# EAGLE design Adapter_Board(v1) (EAGLE 9.6.2)
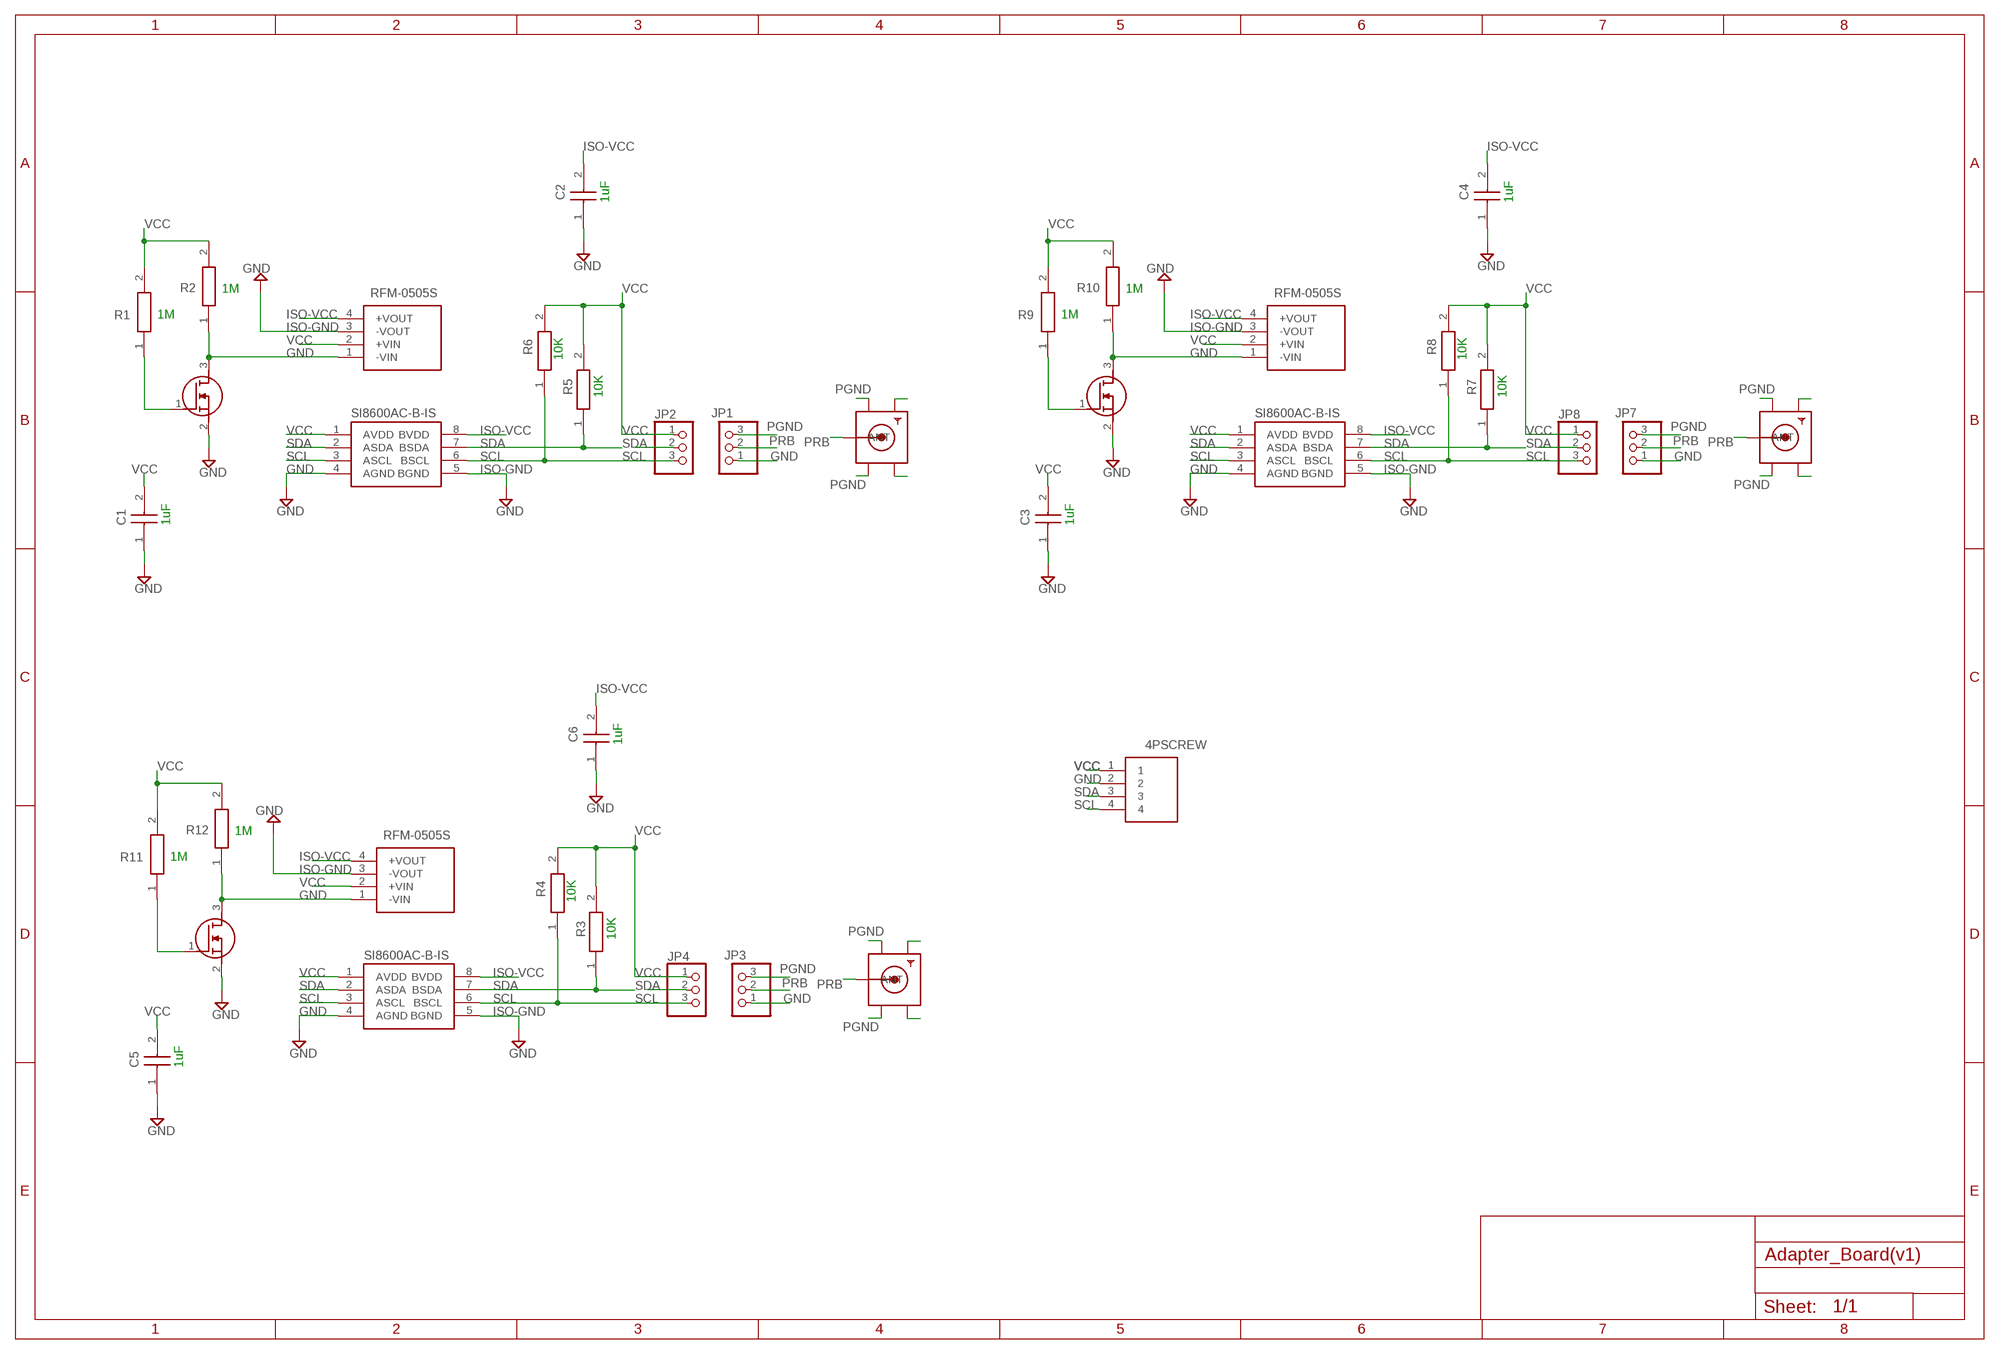
[diagram p0: schematic, sheet 1]

## Parts
4PSCREW  1725672  [1725672]
C1  C1608X5R1E105K080AC  [CAPC1608X80N]
C2  C1608X5R1E105K080AC  [CAPC1608X80N]
C3  C1608X5R1E105K080AC  [CAPC1608X80N]
C4  C1608X5R1E105K080AC  [CAPC1608X80N]
C5  C1608X5R1E105K080AC  [CAPC1608X80N]
C6  C1608X5R1E105K080AC  [CAPC1608X80N]
IC1  SI8600AC-B-IS  [SOIC127P600X175-8N]
IC2  SI8600AC-B-IS  [SOIC127P600X175-8N]
IC4  SI8600AC-B-IS  [SOIC127P600X175-8N]
JP1  PINHD-1X3  [1X03]
JP2  PINHD-1X3  [1X03]
JP3  PINHD-1X3  [1X03]
JP4  PINHD-1X3  [1X03]
JP7  PINHD-1X3  [1X03]
JP8  PINHD-1X3  [1X03]
PS1  RFM-0505S  [RFM0505S]
PS3  RFM-0505S  [RFM0505S]
PS4  RFM-0505S  [RFM0505S]
Q1  BSS119NH6327XTSA1  [SOT95P260X110-3N]
Q2  BSS119NH6327XTSA1  [SOT95P260X110-3N]
Q3  BSS119NH6327XTSA1  [SOT95P260X110-3N]
R1  ERJ-3EKF1004V  [RESC1608X55N]
R2  ERJ-3EKF1004V  [RESC1608X55N]
R3  CRCW060310K0FKEAHP  [RESC1608X50N]
R4  CRCW060310K0FKEAHP  [RESC1608X50N]
R5  CRCW060310K0FKEAHP  [RESC1608X50N]
R6  CRCW060310K0FKEAHP  [RESC1608X50N]
R7  CRCW060310K0FKEAHP  [RESC1608X50N]
R8  CRCW060310K0FKEAHP  [RESC1608X50N]
R9  ERJ-3EKF1004V  [RESC1608X55N]
R10  ERJ-3EKF1004V  [RESC1608X55N]
R11  ERJ-3EKF1004V  [RESC1608X55N]
R12  ERJ-3EKF1004V  [RESC1608X55N]
X1  SMACONNECTOR_EDGE  [SMA_EDGELAUNCH]
X2  SMACONNECTOR_EDGE  [SMA_EDGELAUNCH]
X4  SMACONNECTOR_EDGE  [SMA_EDGELAUNCH]

## Nets
GND: 4PSCREW.2 C1.1 C2.1 C3.1 C4.1 C5.1 C6.1 IC1.4(AGND) IC2.4(AGND) IC4.4(AGND) JP1.1 JP3.1 JP7.1 PS1.1(-VIN) PS3.1(-VIN) PS4.1(-VIN) Q1.2(S) Q1.3(D) Q2.2(S) Q2.3(D) Q3.2(S) Q3.3(D) R2.1 R10.1 R12.1
ISO-GND: IC1.5(BGND) IC2.5(BGND) IC4.5(BGND) PS1.3(-VOUT) PS3.3(-VOUT) PS4.3(-VOUT) ; supply symbol labelled GND
ISO-VCC: C2.2 C4.2 C6.2 IC1.8(BVDD) IC2.8(BVDD) IC4.8(BVDD) PS1.4(+VOUT) PS3.4(+VOUT) PS4.4(+VOUT)
N$2: Q1.1(G) R1.1
N$3: X4.GND@3(GND2)
N$4: X2.GND@3(GND2)
N$5: X2.GND@1(GND4)
N$7: X4.GND@1(GND4)
N$8: Q3.1(G) R11.1
N$11: X1.GND@3(GND2)
N$12: X1.GND@1(GND4)
N$14: Q2.1(G) R9.1
PGND: JP1.3 JP3.3 JP7.3 X1.GND@2(GND3) X1.GND@4(GND1) X2.GND@2(GND3) X2.GND@4(GND1) X4.GND@2(GND3) X4.GND@4(GND1)
PRB: JP1.2 JP3.2 JP7.2 X1.P(ANT) X2.P(ANT) X4.P(ANT)
SCL: 4PSCREW.4 IC1.3(ASCL) IC1.6(BSCL) IC2.3(ASCL) IC2.6(BSCL) IC4.3(ASCL) IC4.6(BSCL) JP2.3 JP4.3 JP8.3 R4.1 R6.1 R8.1
SDA: 4PSCREW.3 IC1.2(ASDA) IC1.7(BSDA) IC2.2(ASDA) IC2.7(BSDA) IC4.2(ASDA) IC4.7(BSDA) JP2.2 JP4.2 JP8.2 R3.1 R5.1 R7.1
VCC: 4PSCREW.1 C1.2 C3.2 C5.2 IC1.1(AVDD) IC2.1(AVDD) IC4.1(AVDD) JP2.1 JP4.1 JP8.1 PS1.2(+VIN) PS3.2(+VIN) PS4.2(+VIN) R1.2 R2.2 R3.2 R4.2 R5.2 R6.2 R7.2 R8.2 R9.2 R10.2 R11.2 R12.2

## Notes on the sheet
- 1uF | 1uF
- 1M | 1M
- 1M | 1M
- 10K | 10K
- 10K | 10K
- 1uF | 1uF
- 1uF
- 1M
- 1M
- 10K
- 10K
- 1uF

## Library data of the parts
4PSCREW = 4pin_screw:1725672: 4 way vertical PCB terminal,6A 63V Phoenix Contact Non-Fused Terminal Block, 4 Way, Solder Terminals, 26 ??? 20 AWG Through Hole, Nylon, 63 V Source: Datasheet <https://datasheet.datasheetarchive.com/originals/distributors/SFDatasheet-2/sf-00050602.pdf>; DESCRIPTION: 4 way vertical PCB terminal,6A 63V Phoenix Contact Non-Fused Terminal Block, 4 Way, Solder Terminals, 26 ??? 20 AWG Through Hole, Nylon, 63 V; HEIGHT: 8.65mm; MANUFACTURER_NAME: Phoenix Contact; MANUFACTURER_PART_NUMBER: 1725672; MOUSER_PART_NUMBER: 651-1725672; MOUSER_PRICE-STOCK: https://www.mouser.co.uk/ProductDetail/Phoenix-Contact/1725672?qs=Ul7CXFMnlWXX93F9bOV2pQ%3D%3D
C1-C6 = C1608X5R1E105K080AC (1uF):C1608X5R1E105K080AC: MULTILAYER CERAMIC CHIP CAPACITORS, 1608, Commercial grade, general (Up to 75V) Source: Datasheet <https://product.tdk.com/info/en/catalog/datasheets/mlcc_commercial_midvoltage_en.pdf>; DESCRIPTION: MULTILAYER CERAMIC CHIP CAPACITORS, 1608, Commercial grade, general (Up to 75V); HEIGHT: 0.8mm; MANUFACTURER_NAME: TDK; MANUFACTURER_PART_NUMBER: C1608X5R1E105K080AC; MOUSER_PART_NUMBER: 810-C1608X5R1E105K; MOUSER_PRICE-STOCK: https://www.mouser.co.uk/ProductDetail/TDK/C1608X5R1E105K080AC?qs=NRhsANhppD9KvcnEkFA5Bw%3D%3D
IC1 IC2 IC4 = Digital Isolator:SI8600AC-B-IS: Isolator,digital,I2C,1.7MHz,3.7kV,SOIC8N Silicon Labs Si8600AC-B-IS PCB SMT 2-channel I2C Digital Isolator, 3.75 kVrms, 8-Pin SOIC Source: Datasheet <https://datasheet.datasheetarchive.com/originals/distributors/Datasheets_SAMA/8fa95c8fb9148355fcc305de833d4897.pdf>; ARROW_PART_NUMBER: SI8600AC-B-IS; ARROW_PRICE-STOCK: https://www.arrow.com/en/products/si8600ac-b-is/silicon-labs; DESCRIPTION: Isolator,digital,I2C,1.7MHz,3.7kV,SOIC8N Silicon Labs Si8600AC-B-IS PCB SMT 2-channel I2C Digital Isolator, 3.75 kVrms, 8-Pin SOIC; HEIGHT: 1.75mm; MANUFACTURER_NAME: Silicon Labs; MANUFACTURER_PART_NUMBER: Si8600AC-B-IS; MOUSER_PART_NUMBER: 634-SI8600AC-B-IS; MOUSER_PRICE-STOCK: https://www.mouser.co.uk/ProductDetail/Silicon-Labs/SI8600AC-B-IS/?qs=j6MGy4L9yX3Cr1m5JEs1OA%3D%3D
JP1-JP4 JP7 JP8 = adafruit:PINHD-1X3: PIN HEADER
PS1 PS3 PS4 = RFM-0505S:RFM-0505S: RECOM POWER - RFM-0505S - DC-DC CONVERTER, 5V, 0.2A Source: Datasheet <https://www.recom-power.com/pdf/Econoline/RFM.pdf>; DESCRIPTION: RECOM POWER - RFM-0505S - DC-DC CONVERTER, 5V, 0.2A; HEIGHT: 10.5mm; MANUFACTURER_NAME: RECOM Power; MANUFACTURER_PART_NUMBER: RFM-0505S; MOUSER_PART_NUMBER: 919-RFM-0505S; MOUSER_PRICE-STOCK: https://www.mouser.co.uk/ProductDetail/RECOM-Power/RFM-0505S?qs=lYGu3FyN48dRVYKTH5ipqg%3D%3D
Q1-Q3 = BSS119NH6327XTSA1 (NMOS):BSS119NH6327XTSA1: Infineon BSS119NH6327XTSA1 N-channel MOSFET Transistor, 0.19 A, 100 V, 3-Pin SOT-23 Source: Datasheet <https://www.infineon.com/dgdl/Infineon-BSS119N-DS-v02_01-en.pdf?fileId=db3a304335f1f4b6013639b6532a164a>; DESCRIPTION: Infineon BSS119NH6327XTSA1 N-channel MOSFET Transistor, 0.19 A, 100 V, 3-Pin SOT-23; HEIGHT: 1.1mm; MANUFACTURER_NAME: Infineon; MANUFACTURER_PART_NUMBER: BSS119NH6327XTSA1; MOUSER_PART_NUMBER: 726-BSS119NH6327XTSA; MOUSER_PRICE-STOCK: https://www.mouser.co.uk/ProductDetail/Infineon-Technologies/BSS119NH6327XTSA1?qs=LxJ0xX%2FWJR7UdSkkikNkig%3D%3D
R1 R2 R9-R12 = ERJ-3EKF1004V (1M):ERJ-3EKF1004V: Precision Thick Film Chip Resistor, 0603, 0.1W Source: Datasheet <http://industrial.panasonic.com/cdbs/www-data/pdf/RDA0000/AOA0000C86.pdf>; DESCRIPTION: Precision Thick Film Chip Resistor, 0603, 0.1W; HEIGHT: 0.55mm; MANUFACTURER_NAME: Panasonic; MANUFACTURER_PART_NUMBER: ERJ-3EKF1004V; MOUSER_PART_NUMBER: 667-ERJ-3EKF1004V; MOUSER_PRICE-STOCK: https://www.mouser.co.uk/ProductDetail/Panasonic/ERJ-3EKF1004V?qs=6%252BUraArZVSCwybhfQn7iYg%3D%3D
R3-R8 = CRCW060310K0FKEAHP:CRCW060310K0FKEAHP: CRCW Power Resistor 0603 0.25W 10K 1% Vishay CRCW Series Thick Film Power Resistor 0603 Case 10k?? ??1% 0.25W ??100ppm/K Source: Datasheet <http://www.vishay.com/docs/20043/crcwhpe3.pdf>; DESCRIPTION: CRCW Power Resistor 0603 0.25W 10K 1% Vishay CRCW Series Thick Film Power Resistor 0603 Case 10k?? ??1% 0.25W ??100ppm/K; HEIGHT: 0.5mm; MANUFACTURER_NAME: Vishay; MANUFACTURER_PART_NUMBER: CRCW060310K0FKEAHP; MOUSER_PART_NUMBER: 71-CRCW060310K0FKEAH; MOUSER_PRICE-STOCK: https://www.mouser.co.uk/ProductDetail/Vishay-Dale/CRCW060310K0FKEAHP?qs=FlFvgi4rxBwhwmNEaK0SzQ%3D%3D
X1 X2 X4 = adafruit:SMACONNECTOR: SMA Connector 90° DIP SMA Connector, 50 Ohm (4UConnector: 07259)

## Board
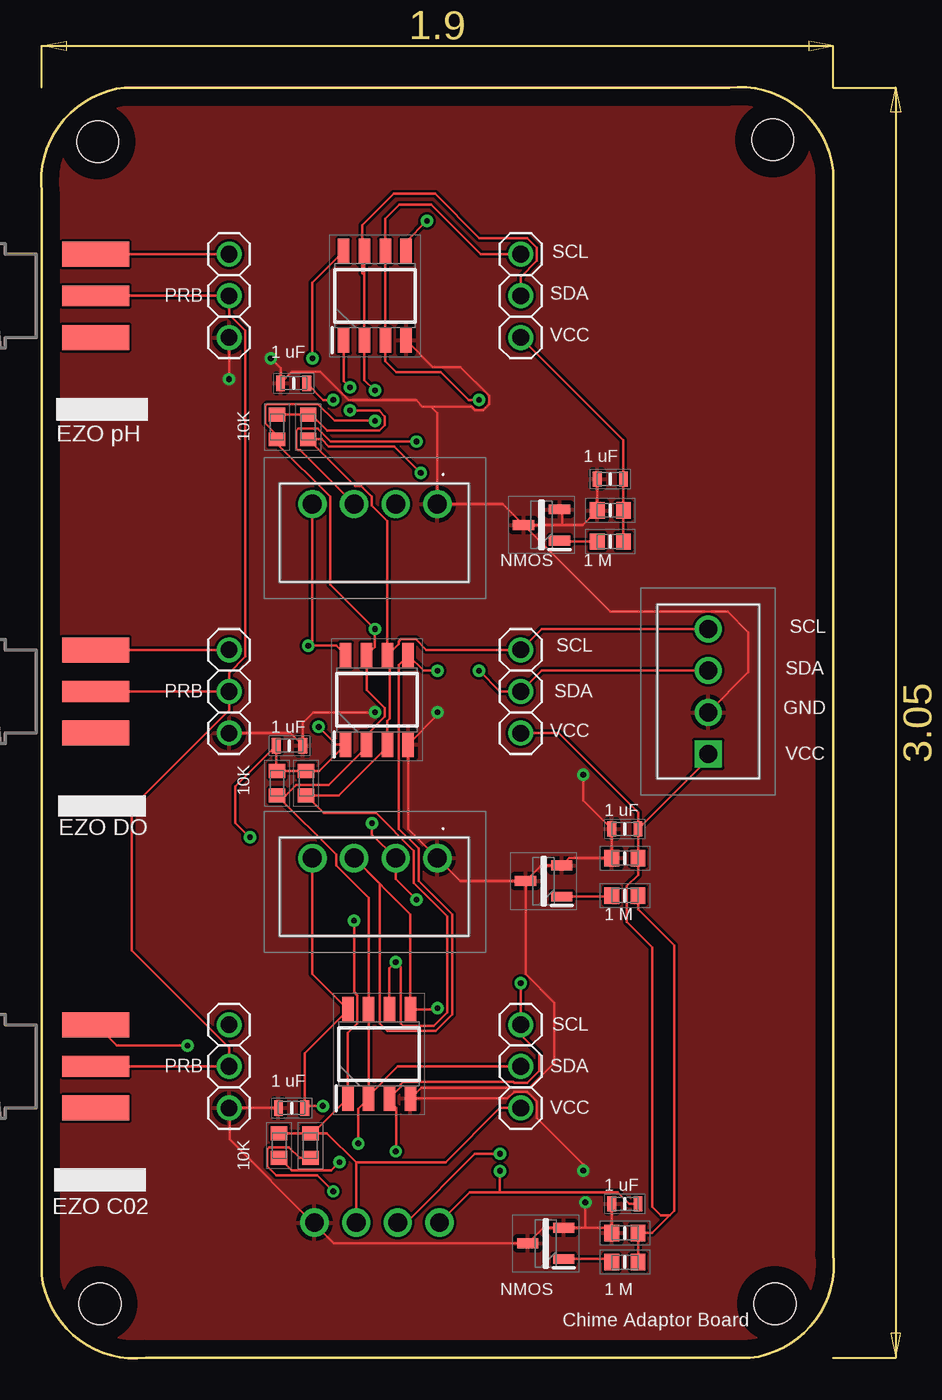
[diagram p1: board, top side]
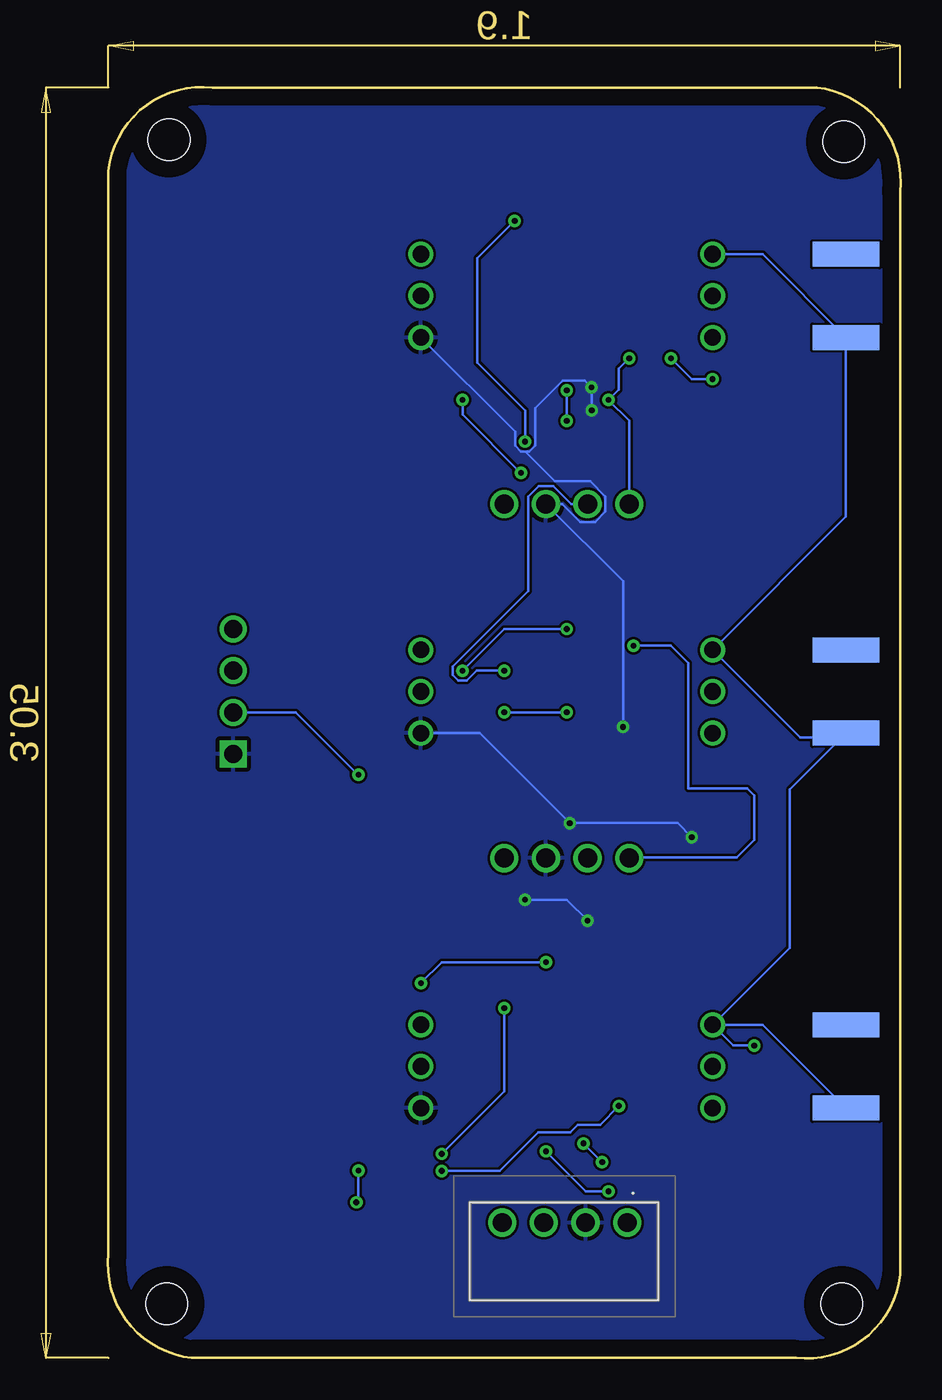
[diagram p2: board, bottom side, seen from below]

Size 48.33 x 77.54 mm. Coordinates in mm from the lower left corner, seen from the top.
Outline: 0.03,71.15 arc-90 5.11,77.5 41.94,77.5 arc-90 48.29,72.42 48.29,6.38 arc-90 43.21,0.03 6.38,0.03 arc-90 0.03,5.11 0.03,71.15
Copper layers (1*16): Top 0.035mm / dielectric 1.5mm / Bottom 0.035mm
Design rules "default": minimum track width 6mil, minimum drill 0.35mm, track to track 6mil, track to pad 6mil, pad to pad 6mil, via to via 6mil, smd to smd 6mil, copper to edge 40mil, drill to drill 6mil, minimum pad ring 10mil, minimum via ring 8mil, stop-mask expansion 4mil, vias tented up to drill 0mil, thermal gap 10mil
Holes 2.54 mm at 44.74,3.34 3.59,3.34 3.46,74.2 44.61,74.33

### Footprints (pad centres in the part's own frame; a part is rotated, then mirrored left to right if it is on the bottom)
1725672 = drill 1.1 pad 1.65 square: 1 0,0 | drill 1.1 pad 1.65: 2 2.54,0; 3 5.08,0; 4 7.62,0
CAPC1608X80N = smd 0.54 x 0.94: 1 -0.8,0; 2 0.8,0
SOIC127P600X175-8N = smd 1.525 x 0.7: 1 -2.712,1.905; 2 -2.712,0.635; 3 -2.712,-0.635; 4 -2.712,-1.905; 5 2.712,-1.905; 6 2.712,-0.635; 7 2.712,0.635; 8 2.712,1.905
1X03 = drill 1.016: 1 -2.54,0; 2 0,0; 3 2.54,0
RFM0505S = drill 1.15 pad 1.725: 1 0,0; 2 2.54,0; 3 5.08,0; 4 7.62,0
SOT95P260X110-3N = smd 1.3 x 0.6: 1 -1.1,0.95; 2 -1.1,-0.95; 3 1.1,0
RESC1608X55N = smd 0.9 x 1: 1 -0.8,0; 2 0.8,0
RESC1608X50N = smd 0.85 x 1: 1 -0.75,0; 2 0.75,0
SMA_EDGELAUNCH = smd 4.064 x 1.524: GND@1 2.032,-2.54; GND@2 2.032,2.54 | smd 4.064 x 1.524 bottom: GND@3 2.032,2.54; GND@4 2.032,-2.54 | smd 4.064 x 1.27: P 2.032,0

### Placement (x,y rotation side)
4PSCREW  40.67,36.86 90 top
C1  35.59,32.29 0 top
C2  35.59,9.43 0 top
C3  15.15,37.37 180 top
C4  15.27,15.27 0 top
C5  34.71,53.63 0 top
C6  15.4,59.47 0 top
IC1  20.61,18.58 90 top
IC2  20.35,64.8 90 top
IC4  20.48,40.17 90 top
JP1  11.46,17.81 90 top
JP2  29.24,17.81 90 top
JP3  11.46,64.8 90 top
JP4  29.24,64.8 90 top
JP7  11.46,40.67 90 top
JP8  29.24,40.67 90 top
PS1  24.16,52.1 180 top
PS3  16.67,8.29 180 bottom
PS4  24.16,30.51 180 top
Q1  30.77,7.02 180 top
Q2  30.64,29.12 180 top
Q3  30.51,50.83 180 top
R1  35.59,5.88 0 top
R2  35.59,30.51 0 top
R3  14.39,56.8 90 top
R4  16.29,56.8 90 top
R5  14.51,12.99 90 top
R6  16.42,12.99 90 top
R7  14.39,35.09 90 top
R8  16.16,35.09 90 top
R9  35.59,28.23 0 top
R10  35.59,7.65 0 top
R11  34.71,49.82 0 top
R12  34.71,51.72 0 top
X1  1.3,40.67 0 top
X2  1.3,64.8 0 top
X4  1.3,17.81 0 top

### Tracks (layer width: path | path; a pad name or v marks a point on that pad's centre or on a via)
GND  (via drill 0.35)
  Top 0.152: C4.1 JP1.1 11.5,15.24 11.5,13.37 16.58,8.29 | PS3.1 16.58,8.29 | 33.05,7.97 Q1.2 30.62,7.97 Q1.3 17.85,7.02 16.58,8.29 | 33.05,7.97 34.48,7.97 R10.1 C2.1 | v33.05,11.46 33.05,11.85 30.24,14.66 30.24,15.68 29.65,16.27 28.83,16.27 28.43,15.86 IC1.4 23.17,16.52 29.78,16.52 31.3,18.04 31.3,21.7 29.54,23.46 Q2.3 | v33.18,9.52 33.18,8.1 33.05,7.97 | Q2.3 25.56,29.12 PS4.1 22.39,32.29 IC4.4 24.16,39.23 v24.16,39.4 | JP7.1 15.19,38.13 C3.1 15.95,38.77 16.58,39.4 v20.35,39.4 | C5.1 R12.1 33.02,50.83 31.78,50.83 | 31.78,50.83 Q3.3 | Q3.3 29.41,50.81 34.69,45.54 41.86,45.54 43.13,44.27 43.13,41.86 4PSCREW.2 | Q3.3 28.14,52.1 PS1.1 24.16,57.65 23.76,58.05 | JP3.1 v11.46,59.72 | v14,60.99 14.6,60.4 C6.1 15.3,60.17 17.03,60.17 18.77,58.43 22.87,58.43 23.25,58.05 23.76,58.05 | IC2.4 23.88,60.47 25.55,60.47 27.31,58.71 27.31,58.2 26.96,57.85 26.45,57.85 26.25,58.05 23.76,58.05 | Q2.3 30.49,30.07 Q2.2 32.19,30.51 R2.1 C1.1 33.05,34.03 v33.05,35.59 | Q3.2 31.78,51.61 31.78,50.83
  Bottom 0.152: v33.05,11.46 33.05,9.91 33.18,9.78 v33.18,9.52 | v20.35,39.4 v24.16,39.4 | v11.46,59.72 12.73,59.72 v14,60.99 | v33.05,35.59 36.86,39.4 4PSCREW.2
  pour Top: 0.03,77.5 48.29,77.5 48.29,0.03 0.03,0.03
ISO-GND  (via drill 0.35)
  Top 0.152: PS3.3 22.26,8.29 26.45,12.48 v27.97,12.48 | v24.16,21.37 24.08,21.29 IC1.5 22.51,27.09 PS4.3 20.66,28.93 20.66,20.43 21.1,19.99 24.08,19.99 25.08,20.99 25.08,27.08 23.02,29.14 23.02,31.09 21.81,32.31 21.81,42.3 IC4.5 23.32,41.94 v24.16,41.94 | PS1.3 15.79,55.4 15.7,55.4 15.56,55.53 15.56,56.57 15.7,56.71 16.89,56.71 17.68,55.91 v22.89,55.91 | v23.53,69.38 22.26,68.11 IC2.5
  Bottom 0.152: v27.97,12.48 24.16,16.29 v24.16,21.37 | v24.16,41.94 25.85,41.94 26.45,41.34 26.96,41.34 27.31,41.69 27.31,42.2 22.72,46.79 22.72,52.56 22.08,53.2 21.17,53.2 20.08,52.1 PS1.3 | v22.89,55.91 22.89,57.82 25.82,60.74 25.82,67.09 v23.53,69.38
ISO-VCC  (via drill 0.35)
  Top 0.152: C2.2 35.86,9.43 35.16,10.13 27.97,10.13 | 27.97,10.13 26.13,10.13 PS3.4 | v17.18,15.4 16.2,15.4 C4.2 16.07,18.61 18.7,21.24 IC1.8 16.54,23.45 PS4.4 | v27.97,11.44 27.97,10.13 | IC4.8 17.99,43.47 v16.29,43.47 16.54,43.72 PS1.4 | IC2.8 16.54,65.61 v16.54,60.99 | v17.81,58.45 17.22,58.45 C6.2
  Bottom 0.152: v27.97,11.44 24.44,11.44 22.08,13.8 20.15,13.8 19.69,14.26 18.32,14.26 v17.18,15.4 | PS4.4 16.52,30.54 10,30.54 8.92,31.62 8.92,34.32 9.35,34.75 12.94,34.75 12.94,42.4 14,43.47 v16.29,43.47 | v16.54,60.99 17.18,60.36 17.18,59.09 v17.81,58.45 16.54,57.18 PS1.4
N$2
  Top 0.152: Q1.1 34.6,6.07 R1.1
N$8
  Top 0.152: Q3.1 31.68,49.82 R11.1
N$14
  Top 0.152: Q2.1 34.73,28.17 R9.1
PGND  (via drill 0.35)
  Top 0.152: X1.GND@2 JP7.3 | X2.GND@2 JP3.3 | X4.GND@2 4.61,19.08 v8.92,19.08
  Bottom 0.152: X4.GND@4 8.42,20.35 JP1.3 | X1.GND@4 3.59,37.88 | 3.59,37.88 6.77,34.71 6.77,25.05 JP1.3 | JP3.3 8.42,67.34 X2.GND@4 3.34,51.34 JP7.3 6.13,37.88 3.59,37.88 | v8.92,19.08 10.19,19.08 JP1.3
PRB
  Top 0.152: X4.P JP1.2 11.46,18.95 5.52,24.9 5.52,33.59 11.46,39.54 JP7.2 | X1.P JP7.2 | X2.P JP3.2 11.46,63.67 12.46,62.67 12.46,42.8 11.46,41.81 JP7.2
SCL  (via drill 0.35)
  Top 0.152: v21.62,12.64 21.65,12.66 21.65,15.3 21.24,15.7 IC1.3 21.93,16.56 21.93,16.72 22.07,16.86 28.8,16.86 28.83,16.82 29.65,16.82 30.36,17.53 30.36,18.61 29.24,19.72 JP2.3 v29.24,22.89 | v17.81,10.19 16.85,11.16 14.34,11.16 13.78,11.72 13.78,12.76 13.92,12.89 15.11,12.89 15.76,12.24 R6.1 | IC1.6 21.24,23.78 v21.62,24.16 21.93,23.85 21.93,20.43 22.07,20.3 23.95,20.3 24.77,21.12 24.77,26.96 22.72,29.01 22.72,30.97 20.43,33.26 17.24,33.26 R8.1 18.16,34.34 21.12,37.29 IC4.3 21.12,38.88 21.27,39.03 21.27,42.73 IC4.6 | 4PSCREW.4 30.51,44.48 JP8.3 23.49,43.21 22.83,43.87 21.94,43.87 21.81,43.74 21.81,43.57 IC4.6 | IC4.6 21.12,51.07 20.18,52.01 20.18,52.56 19.54,53.2 19.15,53.2 R4.1 17.11,56.05 17.55,55.61 21.55,55.61 v23.15,54.01 | v26.7,58.45 26.06,58.45 24.36,60.16 21.65,60.16 20.99,60.82 IC2.3 IC2.6 20.99,69.5 21.85,70.36 23.78,70.36 26.8,67.34 JP4.3
  Bottom 0.152: v21.62,12.64 19.18,10.19 v17.81,10.19 | v21.62,24.16 27.97,24.16 v29.24,22.89 | v23.15,54.01 26.7,57.57 v26.7,58.45
SDA  (via drill 0.35)
  Top 0.152: R5.1 15.29,11.46 17.69,11.46 v18.2,11.97 | v19.34,13.12 19.34,15.23 IC1.2 | IC1.2 19.97,16.03 21.76,17.81 JP2.2 | IC1.2 IC1.7 19.97,28.08 17.99,30.06 17.99,30.73 R7.1 14.92,34.34 15.57,34.99 17.55,34.99 19.85,37.29 IC4.2 19.85,38.04 20.96,39.15 20.96,39.66 19.85,40.77 IC4.7 20.35,43.39 v20.35,44.48 17.64,47.2 17.64,52.56 14.39,55.81 R3.1 14.39,56.31 13.66,57.03 13.66,58.07 13.79,58.21 16.89,58.21 17.91,57.18 v20.35,57.18 | 4PSCREW.3 30.51,41.94 JP8.2 27.97,40.67 v26.7,41.94 | v20.35,59.04 19.72,59.68 IC2.2 19.72,66.07 | IC2.7 19.72,66.07 | JP4.2 29.24,65.94 30.24,66.93 30.24,67.75 29.65,68.34 26.73,68.34 24.04,71.03 21.5,71.03 19.59,69.12 19.59,66.2 19.72,66.07
  Bottom 0.152: v19.34,13.12 v18.2,11.97 | v26.7,41.94 24.16,44.48 v20.35,44.48 | v20.35,57.18 v20.35,59.04
VCC  (via drill 0.35)
  Top 0.152: R5.2 R6.2 | 19.21,11.96 17.43,13.74 R6.2 | 19.21,11.96 19.21,11.97 24.67,11.97 27.97,15.27 JP2.1 | 19.21,11.96 PS3.2 | R6.2 16.58,13.74 IC1.1 18.7,19.85 19.28,20.43 19.28,22.15 19.08,22.34 v19.08,26.7 | JP8.1 31.57,38.13 36.39,33.31 C1.2 | v22.89,27.97 21.62,29.24 PS4.2 20.17,31.96 v20.17,32.65 | v12.73,31.78 11.85,32.67 11.85,34.87 C3.2 14.35,35.87 R7.2 R8.2 16.96,35.84 IC4.1 17.99,37.45 v16.93,38.52 | JP4.1 35.51,56 C5.2 R12.2 R11.2 | R3.2 R4.2 16.47,57.55 17.45,56.58 20.61,56.58 20.96,56.93 20.96,57.44 20.61,57.79 18.86,57.79 v18.83,57.82 | v18.84,59.22 18.45,59.61 IC2.1 | 4PSCREW.1 40.67,36.57 C1.2 | R9.2 36.39,27.39 38.59,25.19 38.59,9 38.33,8.73 | 38.33,8.73 37.25,7.65 R10.2 R1.2 | C1.2 R2.2 36.39,29.5 35.72,28.82 35.72,26.62 37.27,25.06 37.27,9.25 37.79,8.73 38.33,8.73
  Bottom 0.152: v19.08,26.7 20.35,27.97 v22.89,27.97 | v12.73,31.78 13.6,32.65 v20.17,32.65 25.66,38.13 JP8.1 | v16.93,38.52 16.93,47.41 PS1.2 20.63,52.1 19.54,51.01 18.63,51.01 17.99,51.65 17.99,52.56 18.94,53.5 21.09,53.5 22.89,55.31 | v18.83,57.82 18.83,59.21 v18.84,59.22 19.27,59.65 20.61,59.65 22.29,57.97 22.29,55.66 22.64,55.31 22.89,55.31 | 22.89,55.31 23.15,55.31 23.5,55.66 23.5,56.52 JP4.1
  pour Bottom: 0.03,77.5 48.29,77.5 48.29,0.03 0.03,0.03

### Text on the board
tPlace: SCL | PRB | SDA | VCC | EZO pH | SCL | SCL | SDA | PRB | SDA | GND | VCC | VCC | EZO DO | SCL | PRB | SDA | VCC | EZO C02 | Chime Adaptor Board
tNames: 1 uF | 10K | 1 uF | NMOS | 1 M | 1 uF | 10K | 1 uF | 1 M | 1 uF | 10K | 1 uF | NMOS | 1 M